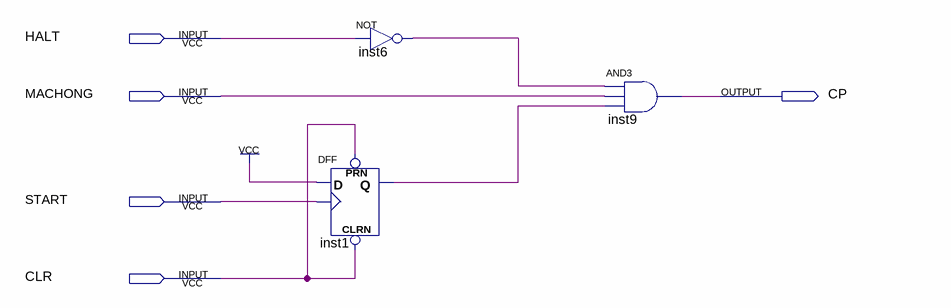
[diagram p0: schematic sheet]
// Quartus schematic start_stop.bdf as structural Verilog: 3 symbols, 5 pins
module start_stop (
  input  HALT,
  input  MACHONG,
  input  START,
  input  CLR,
  output CP
);

  wire inst1_q, inst6_out;

  DFF inst1 (.CLRN(CLR), .CLK(START), .D(1'b1), .PRN(CLR), .Q(inst1_q));
  not inst6 (inst6_out, HALT);
  and inst9 (CP, inst6_out, MACHONG, inst1_q);
endmodule
